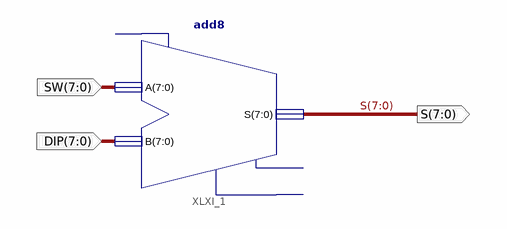
[diagram p0: schematic sheet 1]
// Xilinx ISE schematic Adder.sch (spartan6) as structural Verilog: 1 symbols, 3 ports
module Adder (
  input  [7:0] SW,
  input  [7:0] DIP,
  output [7:0] S
);

  add8 XLXI_1 (.A(SW), .B(DIP), .S(S));  // open: CI, CO, OFL
endmodule
